# EAGLE schematic LiPo Drop Charger v.6 (ATtiny85) -- Dual MCP73831T (EAGLE 6.4)
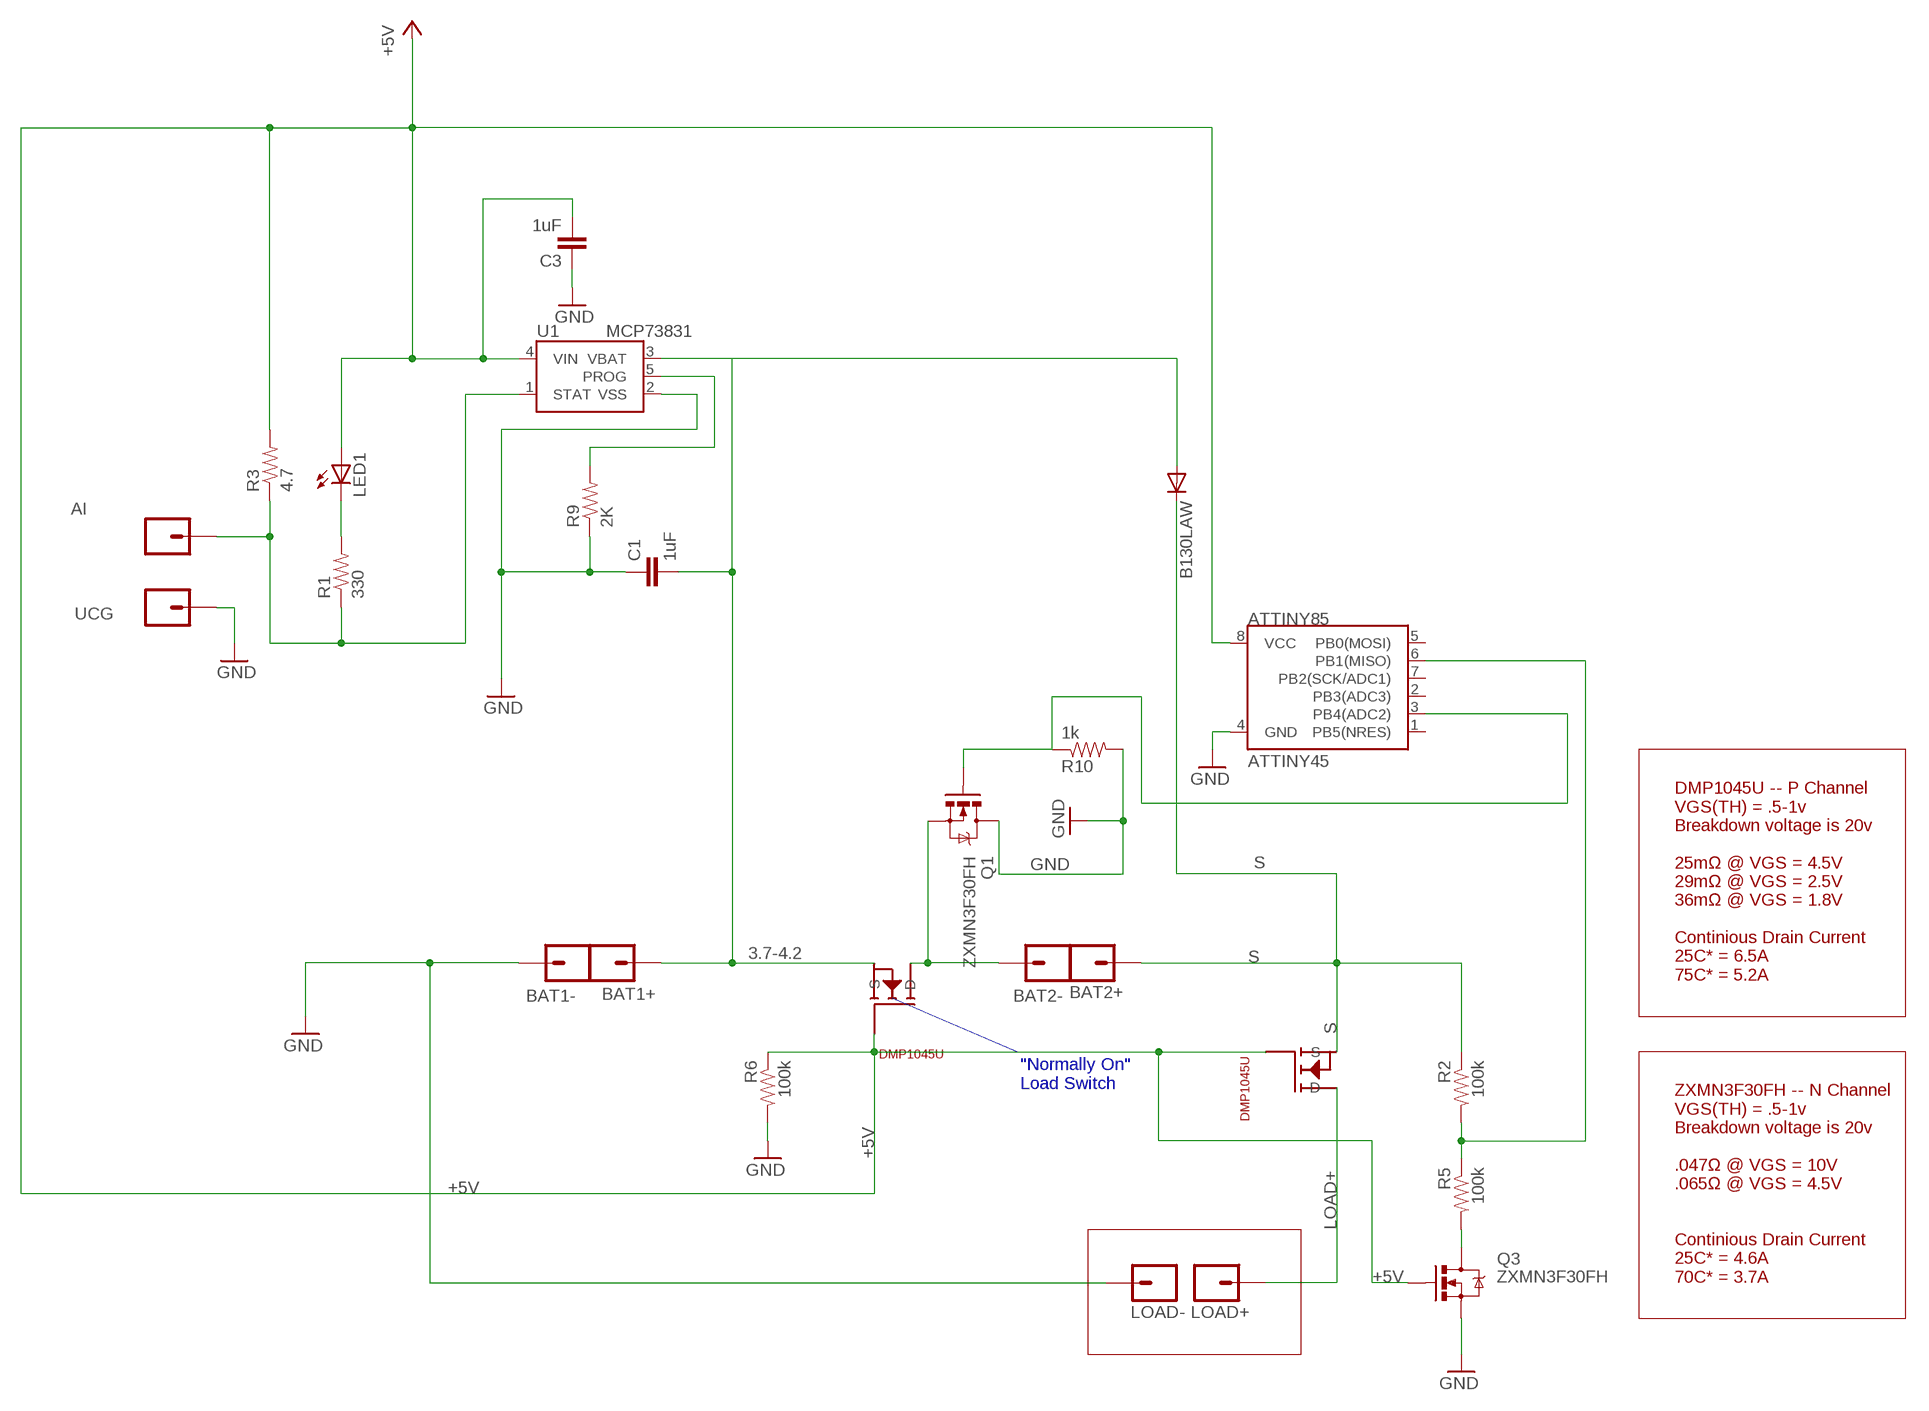
[diagram p0: schematic, sheet 1]

## Parts
AI  M01PTH  [1X01]
ATTINY85  ATTINY45  [SO08-EIAJ]
B130LAW  DIODE-SOD123  [SOD123]
BAT1+  M01PTH  [1X01]
BAT1-  M01PTH  [1X01]
BAT2+  M01PTH  [1X01]
BAT2-  M01PTH  [1X01]
C1  1uF  CAP0805  [0805]
C3  1uF  CAP0805  [0805]
LED1  LEDCHIP-LED0603  [CHIP-LED0603]
LOAD+  M01PTH  [1X01]
LOAD-  M01PTH  [1X01]
Q1  ZXMN3F30FH  MOSFET-NCHANNELSMD  [SOT23-3]
Q3  ZXMN3F30FH  MOSFET-NCHANNELSMD  [SOT23-3]
R1  330  RESISTOR0805-RES  [0805]
R2  100k  RESISTOR0805-RES  [0805]
R3  4.7  RESISTOR0805-RES  [0805]
R5  100k  RESISTOR0805-RES  [0805]
R6  100k  RESISTOR0805-RES  [0805]
R9  2K  RESISTOR0805-RES  [0805]
R10  1k  RESISTOR0805-RES  [0805]
U1  MCP73831  [SOT23-5]
U$1  DMP1045U  [SOT-23]
U$2  DMP1045U  [SOT-23]
UCG  M01PTH  [1X01]

## Nets
3.7OUT: BAT2-.1 Q1.2(S) U$1.3(D)
7.4: B130LAW.A BAT1+.1 C1.2 U1.3(VBAT) U$1.2(S)
+5V: ATTINY85.8(VCC) C3.2 LED1.A Q3.1(G) R3.2 R6.1 U1.4(VIN) U$1.1(G) U$2.1(G)
GND: ATTINY85.4(GND) BAT1-.1 C1.1 C3.1 LOAD-.1 Q1.3(D) Q3.2(S) R6.2 R9.1 R10.2 U1.2(VSS) UCG.1
LOAD+: LOAD+.1 U$2.3(D)
N$1: ATTINY85.6(PB1(MISO)) R2.2 R5.1
N$2: AI.1 R1.1 R3.1 U1.1(STAT)
N$4: ATTINY85.3(PB4(ADC2)) Q1.1(G) R10.1
N$5: Q3.3(D) R5.2
N$9: R9.2 U1.5(PROG)
N$10: LED1.C R1.2
S: B130LAW.C BAT2+.1 R2.1 U$2.2(S)
Unconnected: ATTINY85.1(PB5(NRES)) ATTINY85.2(PB3(ADC3)) ATTINY85.5(PB0(MOSI)) ATTINY85.7(PB2(SCK/ADC1))

## Buses
B$3

## Notes on the sheet
- 3.7-4.2
- DMP1045U -- P Channel
  VGS(TH) = .5-1v
  Breakdown voltage is 20v
  
  25mΩ @ VGS = 4.5V 
  29mΩ @ VGS = 2.5V 
  36mΩ @ VGS = 1.8V
  
  Continious Drain Current
  25C* = 6.5A
  75C* = 5.2A
- "Normally On"
  Load Switch
- ZXMN3F30FH -- N Channel
  VGS(TH) = .5-1v
  Breakdown voltage is 20v
  
  .047Ω @ VGS = 10V 
  .065Ω @ VGS = 4.5V 
  
  
  Continious Drain Current
  25C* = 4.6A
  70C* = 3.7A

## Library data of the parts
AI BAT1+ BAT1- BAT2+ BAT2- LOAD+ LOAD- UCG = SparkFun:M01: Header 1 Standard 1-pin 0.1" header. Use with straight break away headers (SKU : PRT-00116), right angle break away headers (PRT-00553), swiss pins (PRT-00743), machine pins (PRT-00117), and female headers (PRT-00115).
ATTINY85 = SparkFun:ATTINY45: Atmel ATTiny45
B130LAW = diode:DIODE-: DIODE
C1 C3 = SparkFun:CAP: Capacitor Standard 0603 ceramic capacitor, and 0.1" leaded capacitor.
LED1 = led:LED: LED OSRAM: - CHIPLED LG R971, LG N971, LY N971, LG Q971, LY Q971, LO R971, LY R971 LH N974, LH R974 LS Q976, LO Q976, LY Q976 LO Q996 - Hyper CHIPLED LW Q18S LB Q993, LB Q99A, LB R99A - SideLED LS A670, LO A670, LY A670, LG A670, LP A670 LB A673, LV A673, LT A673, LW A673 LH A674 LY A675 LS A676, LA A676, LO A676, LY A676, LW A676 LS A679, LY A679, LG A679 - Hyper Micro SIDELED® LS Y876, LA Y876, LO Y876, LY Y876 LT Y87S - SmartLED LW L88C, LW L88S LB L89C, LB L89S, LG L890 LS L89K, LO L89K, LY L89K LS L896, LA L896, LO L896, LY L896 - TOPLED LS T670, LO T670, LY T670, LG T670, LP T670 LSG T670, LSP T670, LSY T670, LOP T670, LYG T670 LG T671, LOG T671, LSG T671 LB T673, LV T673, LT T673, LW T673 LH T674 LS T676, LA T676, LO T676, LY T676, LB T676, LH T676, LSB T676, LW T676 LB T67C, LV T67C, LT T67C, LS T67K, LO T67K, LY T67K, LW E67C LS E67B, LA E67B, LO E67B, LY E67B, LB E67C, LV E67C, LT E67C LW T67C LS T679, LY T679, LG T679 LS T770, LO T770, LY T770, LG T770, LP T770 LB T773, LV T773, LT T773, LW T773 LH T774 LS E675, LA E675, LY E675, LS T675 LS T776, LA T776, LO T776, LY T776, LB T776 LHGB T686 LT T68C, LB T68C - Hyper Mini TOPLED® LB M676 - Mini TOPLED Santana® LG M470 LS M47K, LO M47K, LY M47K Source: http://www.osram.convergy.de LUXEON: - LUMILED® LXK2-PW12-R00, LXK2-PW12-S00, LXK2-PW14-U00, LXK2-PW14-V00 LXK2-PM12-R00, LXK2-PM12-S00, LXK2-PM14-U00 LXK2-PE12-Q00, LXK2-PE12-R00, LXK2-PE12-S00, LXK2-PE14-T00, LXK2-PE14-U00 LXK2-PB12-K00, LXK2-PB12-L00, LXK2-PB12-M00, LXK2-PB14-N00, LXK2-PB14-P00, LXK2-PB14-Q00 LXK2-PR12-L00, LXK2-PR12-M00, LXK2-PR14-Q00, LXK2-PR14-R00 LXK2-PD12-Q00, LXK2-PD12-R00, LXK2-PD12-S00 LXK2-PH12-R00, LXK2-PH12-S00 LXK2-PL12-P00, LXK2-PL12-Q00, LXK2-PL12-R00 Source: www.luxeon.com KINGBRIGHT: KA-3528ASYC Source: www.kingbright.com
Q1 Q3 = SparkFun:MOSFET-NCHANNEL
R1-R3 R5 R6 R9 R10 = SparkFun:RESISTOR: Resistor Basic schematic elements and footprints for 0603, 1206, and PTH resistors.
U1 = SparkFun:MCP73831: Microchip's MCP73831 Miniature single cell, fully integrated Li-Ion, Li-polymer charge management controller http://ww1.microchip.com/downloads/en/DeviceDoc/21984a.pdf
U$1 U$2 = zak:DMP1045U